# EAGLE design lhsspi (EAGLE 6.4)
AUTHOR_NAME: kps; PROJECT_NAME: Split keyboard; VERSION: 20130817
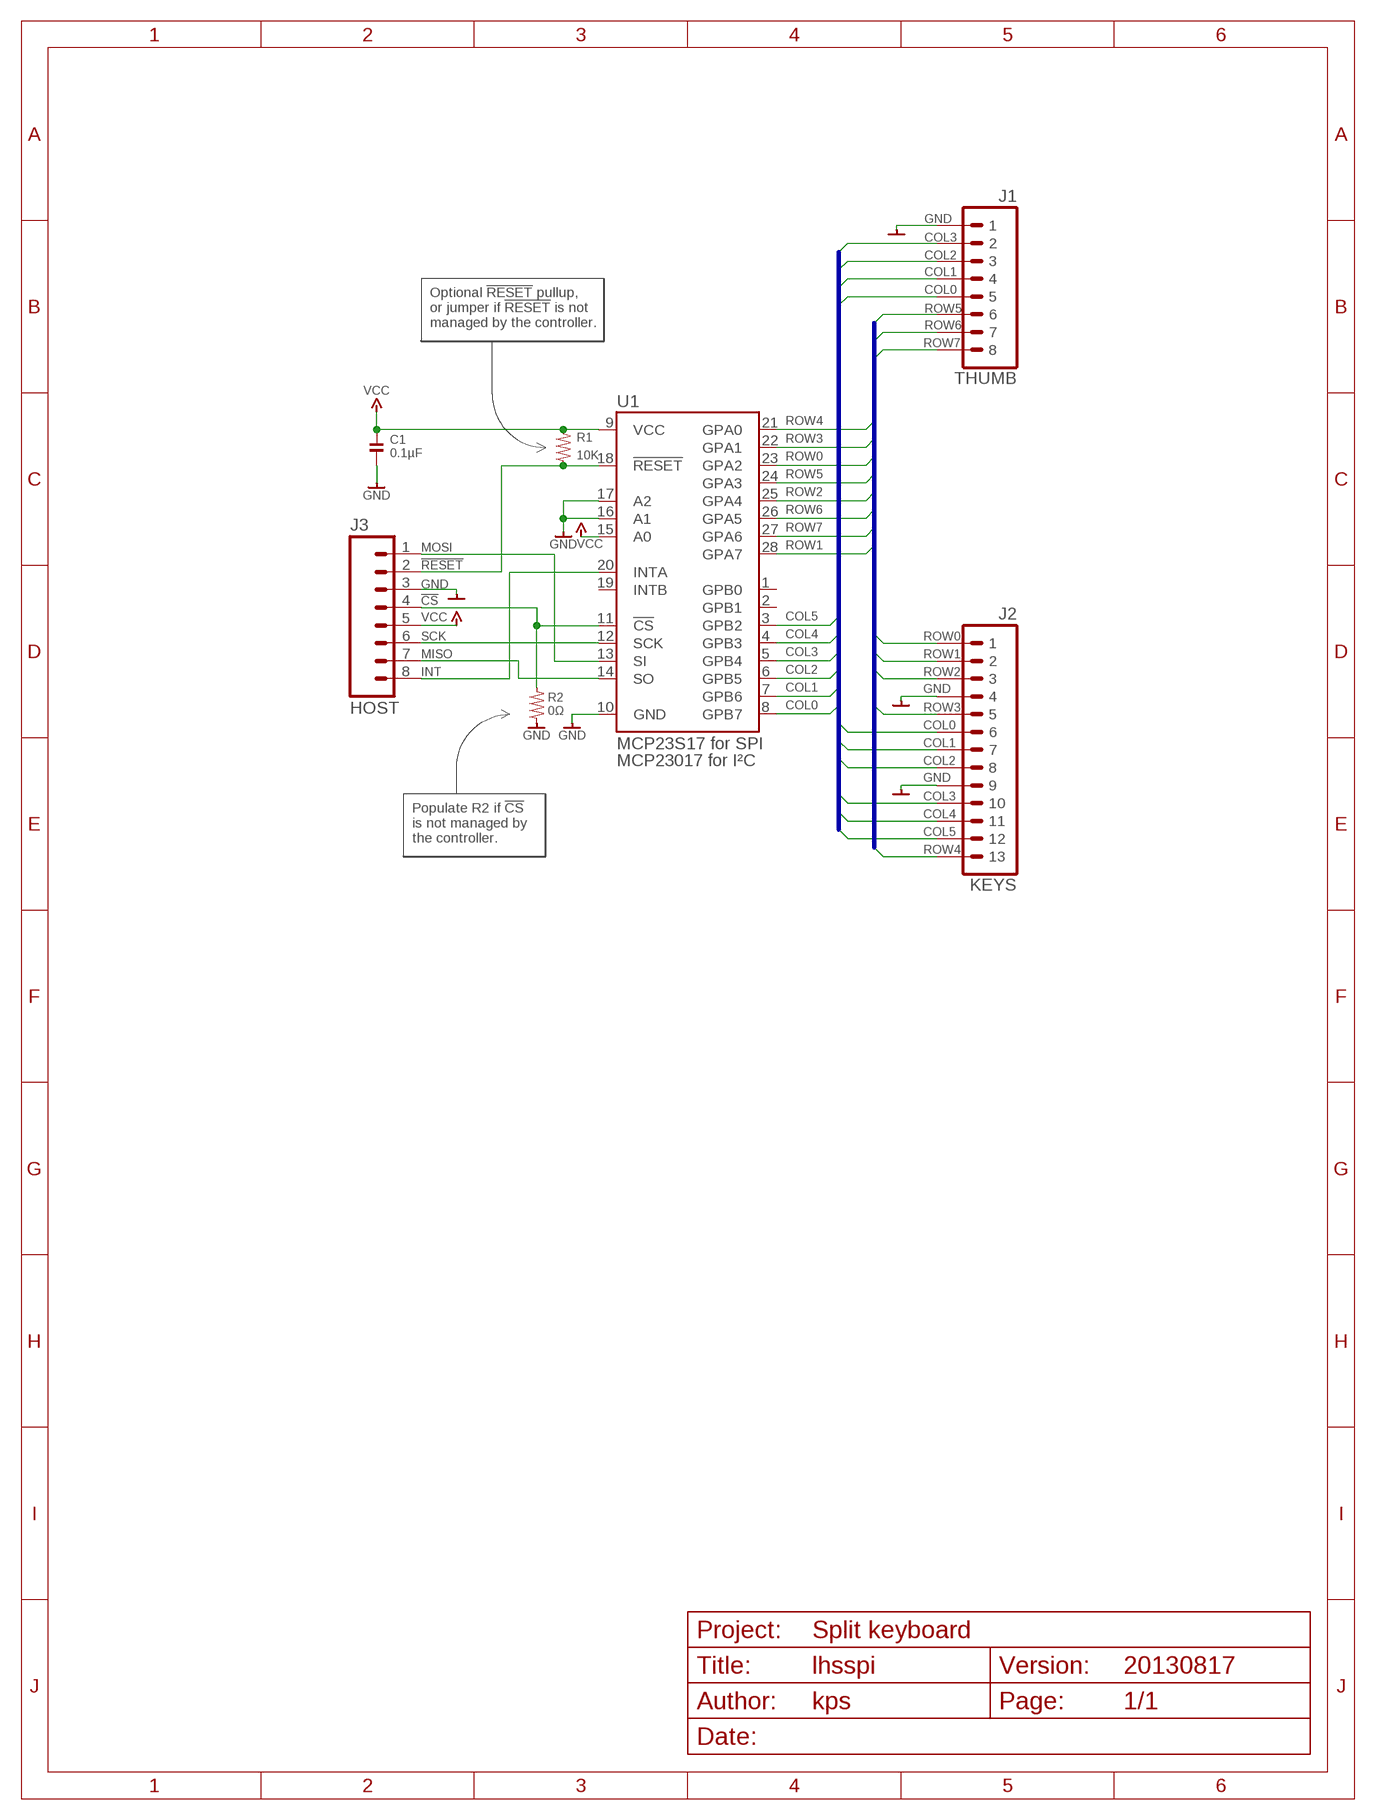
[diagram p0: schematic, sheet 1]

## Parts
C1  0.1µF  CAPACITOR-SCH200-1206  [SMD-1206]
J1  THUMB  J-8-2510  [J-8-2510]
J2  KEYS  J-13-100-ALT-L  [J-13-100-ALT-L]
J3  HOST  J-8-2510  [J-8-2510]
R1  10K  RESISTOR-1206  [SMD-1206]
R2  0Ω  RESISTOR-1206  [SMD-1206]
U1  MCP23S17 for SPI  IC-MCP23S17-SOIC  [IC-28-SOIC-300]

## Nets
!CS: J3.4 R2.2 U1.11(!CS)
!RESET: J3.2 R1.1 U1.18(!RESET)
COL0: J1.5 J2.P6 U1.8(GPB7)
COL1: J1.4 J2.P7 U1.7(GPB6)
COL2: J1.3 J2.P8 U1.6(GPB5)
COL3: J1.2 J2.P10 U1.5(GPB4)
COL4: J2.P11 U1.4(GPB3)
COL5: J2.P12 U1.3(GPB2)
GND: C1.2 J1.1 J2.P4 J2.P9 J3.3 R2.1 U1.10(GND) U1.16(A1) U1.17(A2)
INT: J3.8 U1.20(INTA)
MISO: J3.7 U1.14(SO)
MOSI: J3.1 U1.13(SI)
ROW0: J2.P1 U1.23(GPA2)
ROW1: J2.P2 U1.28(GPA7)
ROW2: J2.P3 U1.25(GPA4)
ROW3: J2.P5 U1.22(GPA1)
ROW4: J2.P13 U1.21(GPA0)
ROW5: J1.6 U1.24(GPA3)
ROW6: J1.7 U1.26(GPA5)
ROW7: J1.8 U1.27(GPA6)
SCK: J3.6 U1.12(SCK)
VCC: C1.1 J3.5 R1.2 U1.9(VCC) U1.15(A0)
Unconnected: U1.1(GPB0) U1.2(GPB1) U1.19(INTB)

## Buses
COL[0..5]
ROW[0..7]

## Notes on the sheet
- Optional !RESET! pullup,
  or jumper if !RESET! is not
  managed by the controller.
- MCP23017 for I²C
- Populate R2 if !CS!
  is not managed by
  the controller.

## Library data of the parts
C1 = misc:CAPACITOR-SCH200
J1 = conn:J-8: 8 pin connector
J2 = conn:J-13: 13 pin connector
J3 = wtf:J-8: 8 pin connector
R1 R2 = misc:RESISTOR
U1 = ic:IC-MCP23S17: Microchip 16-bit I/O Expander MCP23017 - I²C MCP23018 - I²C, open collector, 5V tolerant MCP23S17 - SPI, addressing MCP23S18 - SPI, open collector, 5V tolerant

## Board
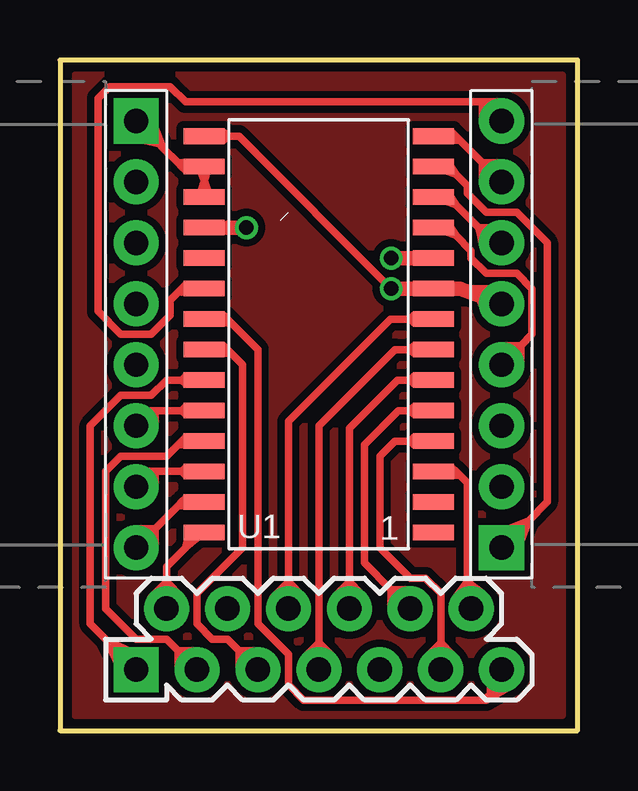
[diagram p1: board, top side]
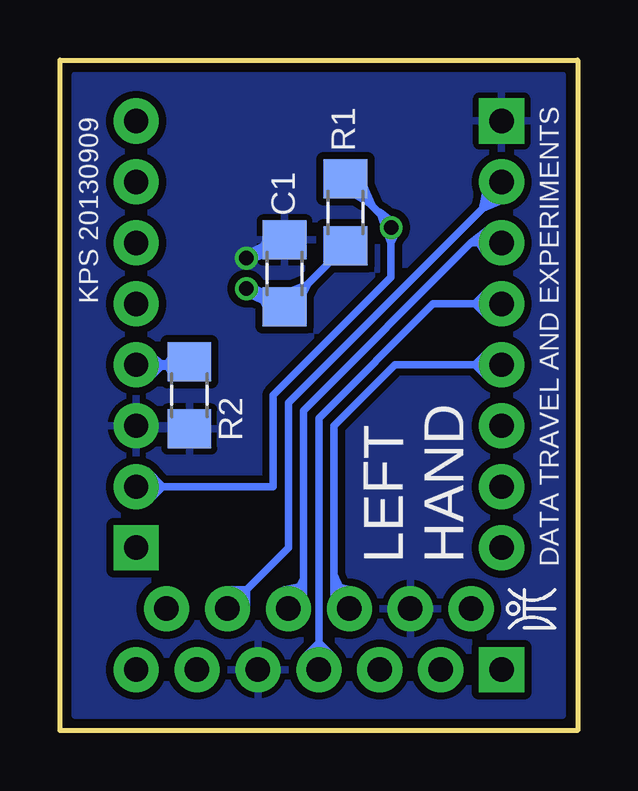
[diagram p2: board, bottom side, seen from below]

Size 21.59 x 27.94 mm. Coordinates in mm from the lower left corner, seen from the top.
Outline: 0,0 21.59,0 21.59,27.94 0,27.94 0,0
Copper layers (1*16): Top 0.0356mm / dielectric 1.5011mm / Bottom 0.0356mm
Design rules "LaenPCBOrder": minimum track width 6mil, minimum drill 13mil, track to track 6mil, track to pad 6mil, pad to pad 6mil, via to via 6mil, smd to smd 6mil, copper to edge 15mil, drill to drill 6mil, minimum pad ring 7mil, minimum via ring 7mil, stop-mask expansion 4mil, vias tented up to drill 0mil, thermal gap 10mil

### Footprints (pad centres in the part's own frame; a part is rotated, then mirrored left to right if it is on the bottom)
SMD-1206 = smd 1.626 x 1.829: 1 -1.397,0; 2 1.397,0
J-8-2510 = drill 1.016 pad 1.88 square: 1 0,-8.89 | drill 1.016 pad 1.88: 2 0,-6.35; 3 0,-3.81; 4 0,-1.27; 5 0,1.27; 6 0,3.81; 7 0,6.35; 8 0,8.89
J-13-100-ALT-L = drill 1.016 pad 1.88 square: P1 -7.62,-1.27 | drill 1.016 pad 1.88: P2 -6.35,1.27; P3 -5.08,-1.27; P4 -3.81,1.27; P5 -2.54,-1.27; P6 -1.27,1.27; P7 0,-1.27; P8 1.27,1.27; P9 2.54,-1.27; P10 3.81,1.27; P11 5.08,-1.27; P12 6.35,1.27; P13 7.62,-1.27
IC-28-SOIC-300 = smd 0.65 x 1.7: 1 -8.255,-4.78; 2 -6.985,-4.78; 3 -5.715,-4.78; 4 -4.445,-4.78; 5 -3.175,-4.78; 6 -1.905,-4.78; 7 -0.635,-4.78; 8 0.635,-4.78; 9 1.905,-4.78; 10 3.175,-4.78; 11 4.445,-4.78; 12 5.715,-4.78; 13 6.985,-4.78; 14 8.255,-4.78; 15 8.255,4.78; 16 6.985,4.78; 17 5.715,4.78; 18 4.445,4.78; 19 3.175,4.78; 20 1.905,4.78; 21 0.635,4.78; 22 -0.635,4.78; 23 -1.905,4.78; 24 -3.175,4.78; 25 -4.445,4.78; 26 -5.715,4.78; 27 -6.985,4.78; 28 -8.255,4.78

### Placement (x,y rotation side)
C1  12.22,19.05 90 bottom
J1  3.17,16.51 180 top
J2  10.79,3.81 0 top
J3  18.41,16.51 0 top
R1  9.68,21.59 270 bottom
R2  16.19,13.97 90 bottom
U1  10.79,16.51 90 top

### Tracks (layer width: path | path; a pad name or v marks a point on that pad's centre or on a via)
!CS
  Top 0.305: U1.11 16.19,20.95 16.51,20.64 | 16.51,20.64 17.14,20 17.14,19.68 17.78,19.05 19.05,19.05 19.68,18.41 19.68,16.51 19.21,16.03 | 19.21,16.03 J3.4 | 18.41,16.03 19.21,16.03 | 19.21,16.03 19.21,15.24 | 16.03,20.8 16.51,20.64 | 16.51,20.64 16.19,21.11
  Bottom 0.305: 17.94,15.72 17.3,15.24 17.78,14.76 | 16.83,14.76 17.14,15.24 16.83,15.72
  Bottom 0.406: J3.4 17.3,15.24 17.14,15.24 16.19,15.24 R2.2
!RESET  (via drill 0.6)
  Top 0.305: U1.18 6.99,20.95
  Top 0.61: 6.99,20.95 v7.78,20.95
  Bottom 0.305: 7.78,20.32 v7.78,20.95 7.78,21.08 R1.1 9.13,22.99 8.97,22.83 | 7.78,20.32 7.78,18.89 12.7,13.97 12.7,10.16 17.3,10.16 | 17.3,10.16 J3.2 | 17.94,9.53 17.3,10.16 | 17.3,10.16 17.94,10.79 | 9.05,23.02 8.97,22.83 | 8.97,22.83 8.57,21.91 9.37,22.38 | 7.78,20.32 8.26,21.59 7.62,21.11 7.46,20.95 7.78,20.32
COL0
  Top 0.305: J2.P6 9.53,6.19 | 9.53,6.19 9.53,12.88 13.79,17.14 14.61,17.14 | 14.61,17.14 U1.8 | 8.89,5.56 9.53,6.19 | 9.53,6.19 10.16,5.56 | 14.76,16.99 14.61,17.14 | 14.61,17.14 14.76,17.3
  Bottom 0.305: J1.5 4.29,15.24 | 4.29,15.24 7.62,15.24 10.16,12.7 10.16,6.51 | 10.16,6.03 10.16,5.08 J2.P6 10.16,6.51 | 3.81,15.72 4.29,15.24 | 4.29,15.24 3.81,14.76 | 10.16,6.51 10.16,6.03 | 10.16,6.03 9.53,5.87
COL1
  Top 0.305: J2.P7 10.79,3.65 | 10.79,3.65 10.79,12.7 13.97,15.88 14.61,15.88 | 14.61,15.88 U1.7 | 10.32,3.17 10.79,3.65 | 10.79,3.65 11.27,3.17 | 14.76,15.72 14.61,15.88 | 14.61,15.88 14.76,16.03
  Bottom 0.305: J1.4 4.29,17.78 | 4.29,17.78 6.03,17.78 10.79,13.02 10.79,3.65 | 10.79,3.65 J2.P7 | 3.81,18.26 4.29,17.78 | 4.29,17.78 3.81,17.3 | 10.32,3.17 10.79,3.65 | 10.79,3.65 11.27,3.17
COL2
  Top 0.305: J2.P8 12.06,6.19 | 12.06,6.19 12.06,12.6 14.07,14.61 14.61,14.61 | 14.61,14.61 U1.6 | 11.59,5.71 12.06,6.19 | 12.06,6.19 12.54,5.71 | 14.76,14.45 14.61,14.61 | 14.61,14.61 14.76,14.76
  Bottom 0.305: J1.3 4.13,20.32 | 4.13,20.32 4.45,20.32 | 4.45,20.32 11.43,13.34 11.43,6.35 | 11.43,6.03 11.43,5.08 J2.P8 11.43,6.35 | 4.45,20.32 3.65,20.95 3.81,19.84 4.13,20.32 | 11.43,6.35 11.43,6.03 | 11.43,6.03 12.22,5.87
COL3
  Top 0.305: J2.P10 13.81,5.87 | 13.81,5.87 12.7,6.99 12.7,11.91 14.12,13.34 14.61,13.34 | 14.61,13.34 U1.5 | 13.81,5.24 13.81,5.87 | 13.81,5.87 14.45,5.87 | 14.76,13.18 14.61,13.34 | 14.61,13.34 14.76,13.49
  Bottom 0.305: J1.2 3.49,22.23 3.97,21.75 | 3.97,21.75 12.06,13.65 12.06,7.62 13.81,5.87 | 13.81,5.87 J2.P10 | 3.17,22.07 3.97,21.75 | 3.97,21.75 3.81,22.54 | 13.81,5.08 13.81,5.87 | 13.81,5.87 14.61,5.87
COL4
  Top 0.305: J2.P11 15.88,3.65 | 15.88,3.65 15.88,5.71 15.24,6.35 14.61,6.35 13.34,7.62 13.34,11.43 13.97,12.06 14.61,12.06 | 14.61,12.06 U1.4 | 15.4,3.17 15.88,3.65 | 15.88,3.65 16.35,3.17 | 14.76,11.91 14.61,12.06 | 14.61,12.06 14.76,12.22
COL5
  Top 0.305: J2.P12 16.99,5.24 16.99,6.19 | 16.99,6.19 16.99,10.32 16.67,10.64 | 16.67,10.64 16.51,10.79 | 16.51,10.79 U1.3 | 16.51,5.56 16.99,6.19 | 16.99,6.19 17.62,5.71 | 16.19,10.64 16.67,10.64 | 16.51,10.79 16.35,10.95
GND  (via drill 0.6)
  Top 0.305: J1.1 4.13,24.45 | 4.13,24.45 4.29,24.29 | 4.29,24.29 4.92,23.65 | 4.92,23.65 5.08,23.5 | 5.08,23.5 U1.16 | U1.16 U1.17 | 5.4,23.65 4.92,23.65 | 5.08,23.5 5.24,23.34 | 5.87,22.38 6.19,23.5 U1.16 | 6.19,22.38 5.87,23.34 5.87,23.5 U1.16 | 4.13,24.45 3.49,24.61 3.97,25.08 4.29,24.29
  Top 0.61: U1.10 v13.81,19.68
  Bottom 0.305: v13.81,19.68 13.18,20 12.86,20.8
  Bottom 0.61: v13.81,19.68 12.28,20.43
  pour Bottom (isolate 0.305): 0.64,27.3 20.95,27.3 20.95,0.64 0.64,0.64
INT
  Top 0.305: U1.20 5.08,18.41 | 5.08,18.41 4.6,17.94 4.6,17.3 3.81,16.51 2.54,16.51 1.59,17.46 1.59,26.35 2.06,26.83 4.6,26.83 5.24,26.19 17.62,26.19 | 17.62,26.19 18.41,26.19 J3.8 | 5.24,18.57 5.08,18.41 | 5.08,18.41 5.08,18.26 | 17.62,26.19 17.62,25.4
MISO
  Top 0.305: U1.14 16.51,24.77 | 16.51,24.77 16.67,24.61 | 16.67,24.61 17.62,23.65 | 17.62,23.65 J3.7 | 17.62,23.02 17.62,23.65 | 17.62,23.65 18.41,23.65 | 16.19,24.61 16.67,24.61 | 16.51,24.77 16.35,24.92
MOSI
  Top 0.305: 16.19,23.5 16.51,23.18 | 16.51,23.18 16.99,22.7 16.99,22.38 17.78,21.59 19.05,21.59 20.32,20.32 20.32,9.53 19.53,8.73 | 19.53,8.73 J3.1 | 18.73,8.41 19.53,8.73 | 19.53,8.73 19.21,7.94 | 16.03,23.34 16.51,23.18 | 16.51,23.18 16.19,23.65
  Top 0.406: U1.13 16.19,23.5
N$1
  pour Top (isolate 0.305): 0.64,0.64 0.64,27.3 20.95,27.3 20.95,0.64
ROW0
  Top 0.305: J2.P1 1.91,3.81 | 1.91,3.81 1.27,4.45 1.27,12.7 2.54,13.97 3.81,13.97 4.45,14.61 5.08,14.61 | U1.23 5.08,14.61 | 5.24,14.76 5.08,14.61 | 5.08,14.61 5.24,14.45 | 1.91,3.81 2.54,2.54 3.17,3.17 1.91,3.81
ROW1
  Top 0.305: 4.45,6.19 4.45,6.83 5.24,7.62 | 4.45,6.19 J2.P2 | 5.24,7.62 5.4,8.26 5.56,8.1 5.86,8.1 U1.28 | 6.03,8.26 5.24,7.62 | 3.81,5.56 4.45,6.19 | 4.45,6.19 5.08,5.56
ROW2
  Top 0.305: J2.P3 4.92,3.33 | 4.92,3.33 4.45,3.81 3.17,3.81 1.91,5.08 1.91,10.79 2.54,11.43 4.45,11.43 4.92,11.91 | 4.92,11.91 5.08,12.06 | 5.08,12.06 U1.25 | 5.24,12.22 5.08,12.06 | 5.24,11.91 4.92,11.91 | 4.92,2.54 4.92,3.33 | 4.92,3.33 5.56,3.33
ROW3
  Top 0.305: J2.P5 7.46,3.33 | 7.46,3.33 6.99,3.81 6.35,3.81 5.71,4.45 5.71,5.71 7.62,7.62 7.62,15.24 7.14,15.72 | 6.99,15.88 U1.22 | 6.83,16.03 6.99,15.88 | 6.99,15.88 7.14,15.72 | 7.14,15.72 6.83,15.72 | 7.46,2.7 7.46,3.33 | 7.46,3.33 8.26,3.33
ROW4
  Top 0.305: 17.62,1.27 17.78,1.27 18.89,1.91 J2.P13 17.94,1.43 17.94,2.06 | 17.62,1.27 10.16,1.27 9.53,1.91 9.53,3.17 8.26,4.45 8.26,15.88 7.14,16.99 | 6.99,17.14 U1.21 | 6.83,17.3 6.99,17.14 | 6.99,17.14 7.14,16.99 | 7.14,16.99 6.83,16.99 | 17.62,1.27 18.1,1.59
ROW5
  Top 0.305: U1.24 5.08,13.34 | 5.08,13.34 3.97,13.34 | 3.97,13.34 3.17,13.34 J1.6 | 5.24,13.49 5.08,13.34 | 5.08,13.34 5.24,13.18 | 3.97,13.34 3.97,12.7
ROW6
  Top 0.305: U1.26 5.08,10.79 | 5.08,10.79 3.97,10.79 | 3.97,10.79 3.17,10.79 J1.7 | 5.24,10.95 5.08,10.79 | 5.08,10.79 5.24,10.64 | 3.97,10.79 3.97,10.16
ROW7
  Top 0.305: J1.8 3.97,8.41 | 3.97,8.41 4.92,9.37 | 4.92,9.37 5.08,9.53 | 5.08,9.53 U1.27 | 5.24,9.68 5.08,9.53 | 4.92,9.37 5.24,9.37 | 3.33,8.41 3.97,8.41 | 3.97,8.41 3.97,7.78
SCK
  Top 0.305: 15.88,22.23 16.19,22.23 16.51,21.91 | 16.51,21.91 17.46,20.95 | 17.46,20.95 18.1,20.32 J3.6 | 16.03,22.07 16.51,21.91 | 16.51,21.91 16.19,22.38 | 17.62,20.32 17.46,20.95 | 17.46,20.95 18.41,20.95
  Top 0.406: U1.12 15.88,22.23
VCC  (via drill 0.6)
  Top 0.305: 16.67,18.41 17.78,18.26 | U1.15 6.99,24.77 | 6.99,24.77 7.46,24.77 v13.81,18.41 | 6.99,24.77 6.83,24.61 6.83,24.92 6.99,24.77 | J3.5 17.78,17.3 17.46,18.1 16.99,18.41 18.41,18.41 J3.5
  Top 0.61: J3.5 16.67,18.41 U1.9 v13.81,18.41
  Bottom 0.305: C1.1 12.38,18.23 | 12.2,17.67 10.79,19.08 R1.2 | 12.2,17.67 C1.1 | 12.28,17.67 12.2,17.67 | v13.81,18.41 13.18,18.1 12.86,17.3 | 11.59,17.94 11.27,18.57 12.06,18.26 12.06,17.81 C1.1
  Bottom 0.61: 12.28,17.67 v13.81,18.41

### Text on the board
bPlace: KPS 20130909 | DATA TRAVEL AND EXPERIMENTS | LEFT / HAND
tDocu: 23S17 / 23017 | THUMB: | HOST: